# EAGLE design buttons (EAGLE 6.5.0)
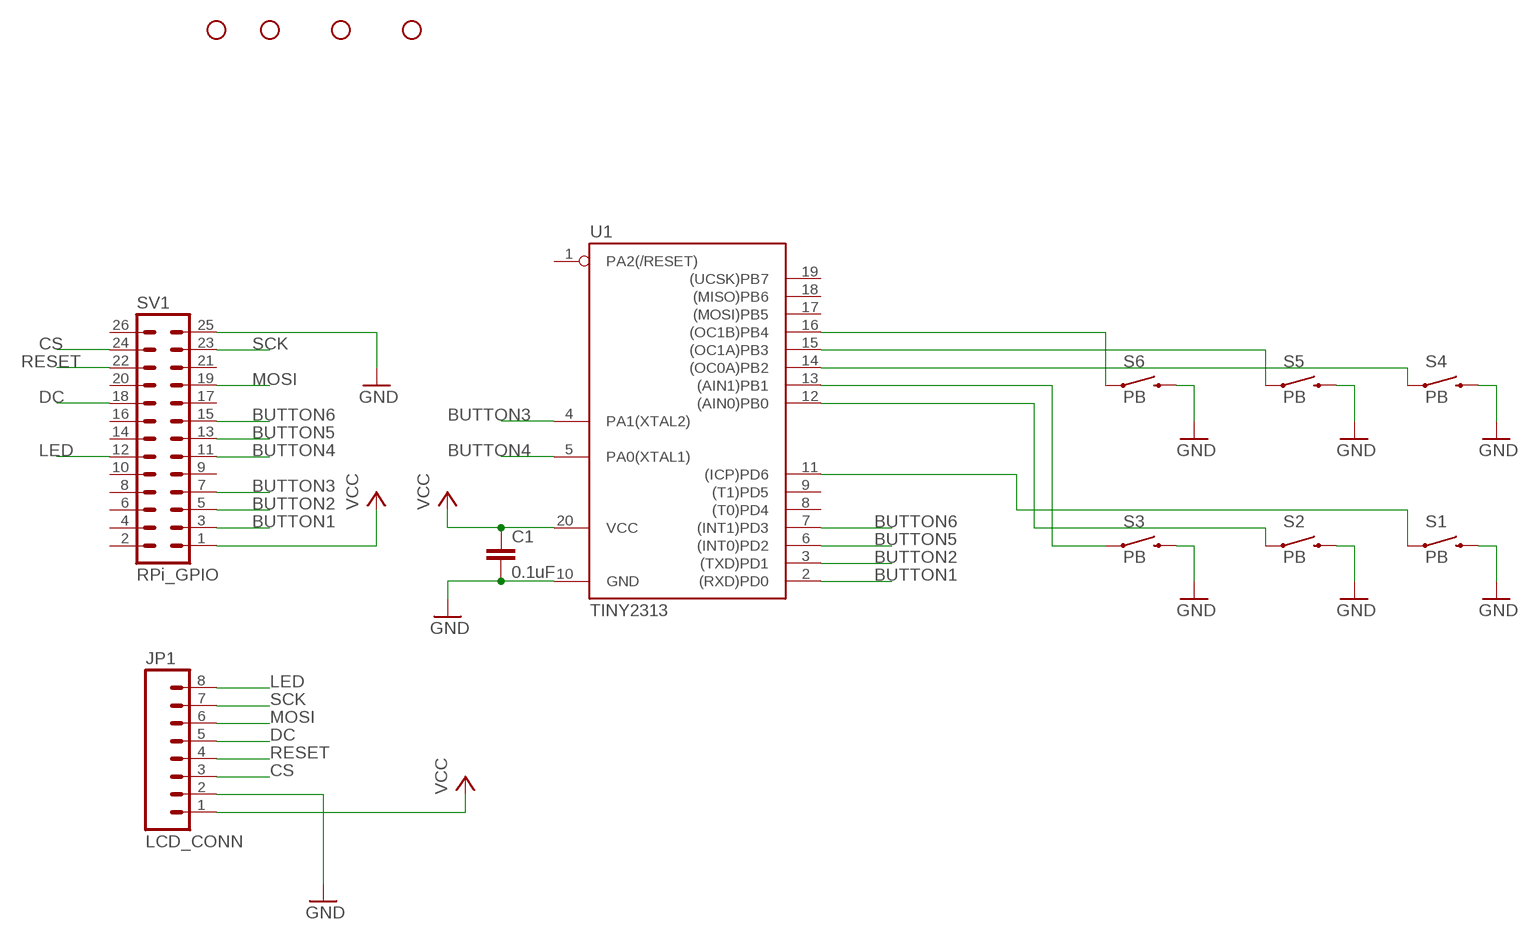
[diagram p0: schematic, sheet 1]

## Parts
C1  0.1uF  C2.5/2  [C2.5-2]
JP1  LCD_CONN  M081X08  [1X08]
S1  PB  SWITCH-MOMENTARY-212MM  [TACTILE-PTH-12MM]
S2  PB  SWITCH-MOMENTARY-212MM  [TACTILE-PTH-12MM]
S3  PB  SWITCH-MOMENTARY-212MM  [TACTILE-PTH-12MM]
S4  PB  SWITCH-MOMENTARY-212MM  [TACTILE-PTH-12MM]
S5  PB  SWITCH-MOMENTARY-212MM  [TACTILE-PTH-12MM]
S6  PB  SWITCH-MOMENTARY-212MM  [TACTILE-PTH-12MM]
STANDOFF1  STAND-OFF  [STAND-OFF]
STANDOFF2  STAND-OFF  [STAND-OFF]
STANDOFF3  STAND-OFF  [STAND-OFF]
STANDOFF4  STAND-OFF  [STAND-OFF]
SV1  RPi_GPIO  ML26  [ML26]
U1  TINY2313  TINY2313-*P*  [DIL20]

## Nets
BUTTON1: SV1.3 U1.2((RXD)PD0)
BUTTON2: SV1.5 U1.3((TXD)PD1)
BUTTON3: SV1.7 U1.4(PA1(XTAL2))
BUTTON4: SV1.11 U1.5(PA0(XTAL1))
BUTTON5: SV1.13 U1.6((INT0)PD2)
BUTTON6: SV1.15 U1.7((INT1)PD3)
CS: JP1.3 SV1.24
DC: JP1.5 SV1.18
GND: C1.2 JP1.2 S1.3 S2.3 S3.3 S4.3 S5.3 S6.3 SV1.25 U1.10(GND)
LED: JP1.8 SV1.12
MOSI: JP1.6 SV1.19
N$1: S6.1 U1.16((OC1B)PB4)
N$2: S5.1 U1.15((OC1A)PB3)
N$3: S4.1 U1.14((OC0A)PB2)
N$4: S3.1 U1.13((AIN1)PB1)
N$5: S2.1 U1.12((AIN0)PB0)
N$6: S1.1 U1.11((ICP)PD6)
RESET: JP1.4 SV1.22
SCK: JP1.7 SV1.23
VCC: C1.1 JP1.1 SV1.1 U1.20(VCC)
Unconnected: SV1.2 SV1.4 SV1.6 SV1.8 SV1.9 SV1.10 SV1.14 SV1.16 SV1.17 SV1.20 SV1.21 SV1.26 U1.1(PA2(/RESET)) U1.8((T0)PD4) U1.9((T1)PD5) U1.17((MOSI)PB5) U1.18((MISO)PB6) U1.19((UCSK)PB7)

## Library data of the parts
C1 = capacitor-wima:C: CAPACITOR naming: grid - package width
JP1 = SparkFun-Connectors:M08: Header 8 Standard 8-pin 0.1" header. Use with straight break away headers (SKU : PRT-00116), right angle break away headers (PRT-00553), swiss pins (PRT-00743), machine pins (PRT-00117), and female headers (PRT-00115).
S1-S6 = SparkFun-Electromechanical:SWITCH-MOMENTARY-2: Various NO switches- pushbuttons, reed, etc; PROD_ID: SWCH-09185
STANDOFF1-STANDOFF4 = SparkFun-Electromechanical:STAND-OFF: #4 Stand Off This is the mechanical footprint for a #4 phillips button head screw. Use the keepout ring to avoid running the screw head into surrounding components. SKU : PRT-00447
SV1 = con-harting-ml:ML26: HARTING; OC_FARNELL: unknown; OC_NEWARK: unknown
U1 = avr-6:TINY2313*: Atmel Tiny2313 2K Flash, 128 bytes EEPROM, 128 bytes RAM

## Board
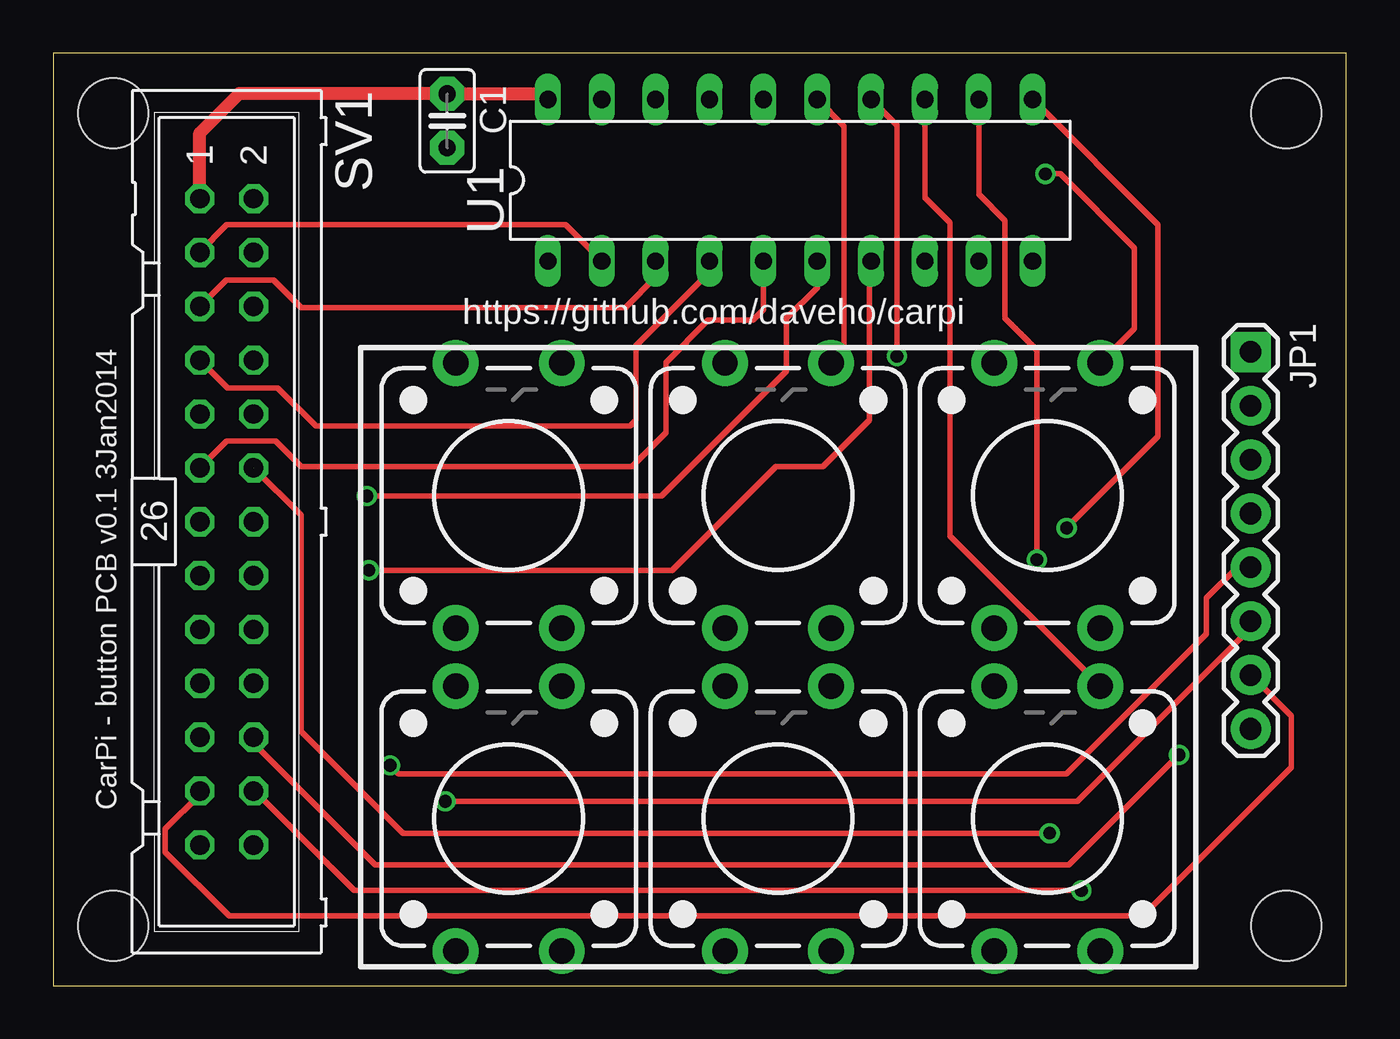
[diagram p1: board, top side]
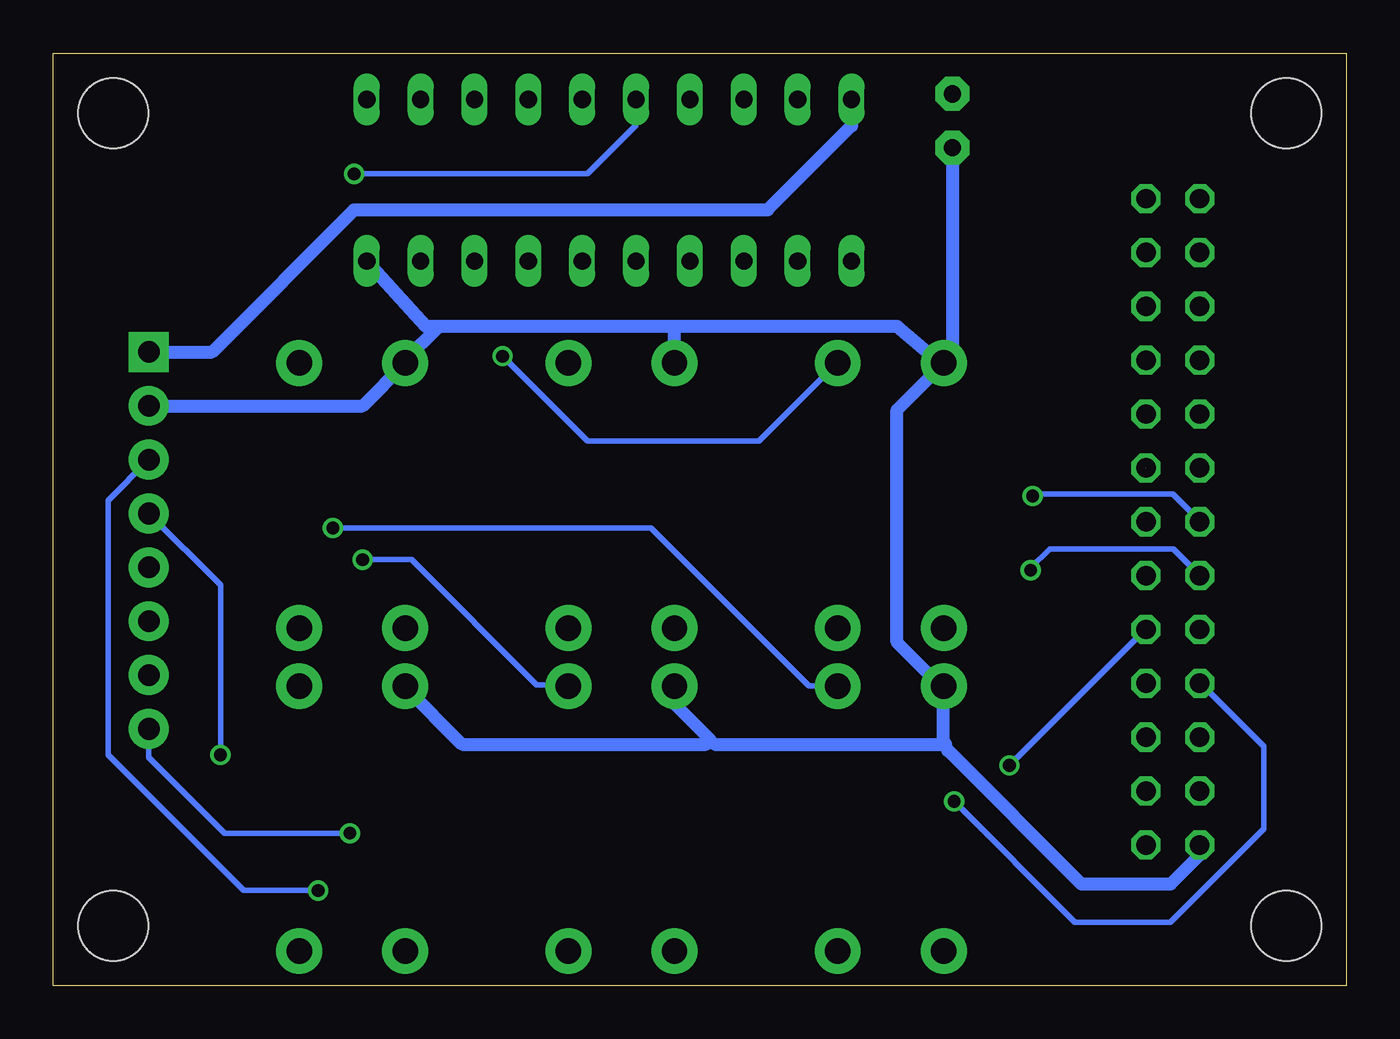
[diagram p2: board, bottom side, seen from below]

Size 61 x 44 mm. Coordinates in mm from the lower left corner, seen from the top.
Outline: 0,0 61,0 61,44 0,44 0,0
Copper layers (1*16): Top 0.0356mm / dielectric 1.5011mm / Bottom 0.0356mm
Design rules "LaenPCBOrder": minimum track width 6mil, minimum drill 13mil, track to track 6mil, track to pad 6mil, pad to pad 6mil, via to via 6mil, smd to smd 6mil, copper to edge 15mil, drill to drill 6mil, minimum pad ring 7mil, minimum via ring 7mil, stop-mask expansion 3mil, vias tented up to drill 0mil, thermal gap 10mil

### Footprints (pad centres in the part's own frame; a part is rotated, then mirrored left to right if it is on the bottom)
C2.5-2 = drill 0.813 pad 1.6 octagon: 1 -1.27,0; 2 1.27,0
1X08 = drill 1.016 pad 1.88 square: 1 0,0 | drill 1.016 pad 1.88: 2 2.54,0; 3 5.08,0; 4 7.62,0; 5 10.16,0; 6 12.7,0; 7 15.24,0; 8 17.78,0
TACTILE-PTH-12MM = drill 1.2 pad 2.159: 1 6.25,-2.5; 2 -6.25,-2.5; 3 6.25,2.5; 4 -6.25,2.5
STAND-OFF = hole 3.302: 0,0
ML26 = drill 0.914 octagon: 1 -15.24,-1.27; 2 -15.24,1.27; 3 -12.7,-1.27; 4 -12.7,1.27; 5 -10.16,-1.27; 6 -10.16,1.27; 7 -7.62,-1.27; 8 -7.62,1.27; 9 -5.08,-1.27; 10 -5.08,1.27; 11 -2.54,-1.27; 12 -2.54,1.27; 13 0,-1.27; 14 0,1.27; 15 2.54,-1.27; 16 2.54,1.27; 17 5.08,-1.27; 18 5.08,1.27; 19 7.62,-1.27; 20 7.62,1.27; 21 10.16,-1.27; 22 10.16,1.27; 23 12.7,-1.27; 24 12.7,1.27; 25 15.24,-1.27; 26 15.24,1.27
DIL20 = drill 0.813 long: 1 -11.43,-3.81; 2 -8.89,-3.81; 3 -6.35,-3.81; 4 -3.81,-3.81; 5 -1.27,-3.81; 6 1.27,-3.81; 7 3.81,-3.81; 8 6.35,-3.81; 9 8.89,-3.81; 10 11.43,-3.81; 11 11.43,3.81; 12 8.89,3.81; 13 6.35,3.81; 14 3.81,3.81; 15 1.27,3.81; 16 -1.27,3.81; 17 -3.81,3.81; 18 -6.35,3.81; 19 -8.89,3.81; 20 -11.43,3.81

### Placement (x,y rotation side)
C1  18.59,40.8 270 top
JP1  56.48,29.9 270 top
S1  21.49,7.89 90 top
S2  34.19,7.89 90 top
S3  46.89,7.89 90 top
S4  21.49,23.13 90 top
S5  34.19,23.13 90 top
S6  46.89,23.13 90 top
STANDOFF1  2.84,41.16 90 top
STANDOFF2  58.16,41.16 0 top
STANDOFF3  2.84,2.84 0 top
STANDOFF4  58.16,2.84 0 top
SV1  8.19,21.89 270 top
U1  34.77,38 0 top

### Tracks (layer width: path | path; a pad name or v marks a point on that pad's centre or on a via)
BUTTON1
  Top 0.254: SV1.3 6.92,34.62 8.2,35.9 24.17,35.9 U1.2
BUTTON2
  Top 0.254: U1.3 28.42,33.42 27,32 11.7,32 10.4,33.3 8.17,33.3 SV1.5
BUTTON3
  Top 0.254: U1.4 30.96,33.66 27.5,30.2 27.5,26.7 27.2,26.4 12.4,26.4 10.6,28.2 8.23,28.2 SV1.7
BUTTON4
  Top 0.254: SV1.11 8.19,25.7 10.5,25.7 11.7,24.5 27.3,24.5 28.9,26.1 28.9,29.4 30.9,31.4 33,31.4 33.5,31.9 U1.5
BUTTON5  (via drill 0.6)
  Top 0.254: U1.6 36.04,32.94 34.6,31.5 34.6,29 28.7,23.1 v14.8,23.1
  Bottom 0.254: SV1.13 6.92,21.92 8.2,23.2 14.7,23.2 v14.8,23.1
BUTTON6  (via drill 0.6)
  Top 0.254: v14.9,19.6 29.2,19.6 34.1,24.5 36.3,24.5 38.5,26.7 38.5,34.11 U1.7
  Bottom 0.254: v14.9,19.6 14.9,19.7 14,20.6 8.17,20.6 SV1.15
CS  (via drill 0.6)
  Top 0.254: SV1.24 9.51,9.19 14.2,4.5 v48.5,4.5
  Bottom 0.254: v48.5,4.5 52,4.5 58.4,10.9 58.4,22.9 JP1.3
DC  (via drill 0.6)
  Top 0.254: v15.9,10.4 16.3,10 47.8,10 54.4,16.6 54.4,18.3 55.84,19.74 JP1.5
  Bottom 0.254: SV1.18 9.49,16.81 v15.9,10.4
GND
  Bottom 0.254: 18.59,29.78 S4.3 | 31.69,31.01 31.6,31.1
  Bottom 0.305: SV1.25 6.92,6.18 | 18.8,11.1 19,11.5 18.9,11.4 | S1.3 19.14,14.14 | S3.3 44.39,14.09 | S4.3 19.18,29.38 | S6.3 44.39,29.51 | 30,11.6 29.8,11.4 30.2,11.4 30,11.6
  Bottom 0.61: 6.92,6.18 8.3,4.8 12.5,4.8 18.8,11.1 | 19,11.5 S1.3 | S2.3 31.69,13.29 30,11.6 | 29.8,11.4 18.9,11.4 | 44.39,14.09 41.7,11.4 30.2,11.4 | 19.18,29.38 21.2,31.1 31.6,31.1 42.8,31.1 | 42.8,31.1 43.41,31.1 U1.10 | JP1.2 46.41,27.36 S6.3 | 44.39,29.51 42.8,31.1 | 19.14,14.14 21.2,16.2 21.2,27.17 S4.3 | C1.2 18.59,29.78 | S5.3 31.69,31.01
LED  (via drill 0.6)  (1 unrouted)
  Top 0.254: v47,7.2 16.5,7.2 11.7,12 11.7,22.2 SV1.12
  Bottom 0.254: JP1.8 56.48,10.78 52.9,7.2 v47,7.2
MOSI  (via drill 0.6)
  Top 0.254: v18.5,8.7 48.3,8.7 56.3,16.7 56.3,17.02 JP1.6
  Bottom 0.254: SV1.19 6.87,14.27 3.9,11.3 3.9,7.4 8.3,3 12.8,3 v18.5,8.7
N$1  (via drill 0.6)
  Top 0.254: S6.1 51,31 51,34.8 47.5,38.3 v46.8,38.3
  Bottom 0.254: U1.16 33.5,40.6 35.8,38.3 v46.8,38.3
N$2
  Top 0.254: S5.1 37.3,29.99 37.3,40.55 U1.15
N$3  (via drill 0.6)
  Top 0.254: v39.8,29.7 39.8,40.59 U1.14
  Bottom 0.254: S4.1 24.02,29.38 27.7,25.7 35.8,25.7 v39.8,29.7
N$4
  Top 0.254: U1.13 41.12,37.18 42.3,36 42.3,21.23 S3.1
N$5  (via drill 0.6)
  Top 0.254: U1.12 43.66,37.34 44.9,36.1 44.9,31.5 46.4,30 v46.4,20.1
  Bottom 0.254: v46.4,20.1 44.1,20.1 38.2,14.2 36.75,14.2 S2.1
N$6  (via drill 0.6)
  Top 0.254: v47.8,21.6 52.1,25.9 52.1,35.91 U1.11
  Bottom 0.254: S1.1 25.34,14.14 32.8,21.6 v47.8,21.6
RESET  (via drill 0.6)
  Top 0.254: SV1.22 9.46,11.44 15.2,5.7 47.9,5.7 v53.1,10.9
  Bottom 0.254: v53.1,10.9 53.1,18.9 JP1.4
SCK
  Top 0.254: SV1.23 6.92,9.02 5.3,7.4 5.3,6.3 8.3,3.3 51.4,3.3 58.4,10.3 58.4,12.74 JP1.7
VCC
  Top 0.305: 18.56,42.1 C1.1 | 23.08,42.07 U1.20
  Top 0.61: SV1.1 6.92,40.22 8.8,42.1 18.56,42.1 | C1.1 23.08,42.07
  Bottom 0.61: U1.20 23.34,40.56 27.3,36.6 46.8,36.6 53.5,29.9 JP1.1

### Text on the board
tPlace: https://github.com/daveho/carpi | CarPi - button PCB v0.1 3Jan2014